# EAGLE schematic attiny85_transistor (EAGLE 9.3.1)
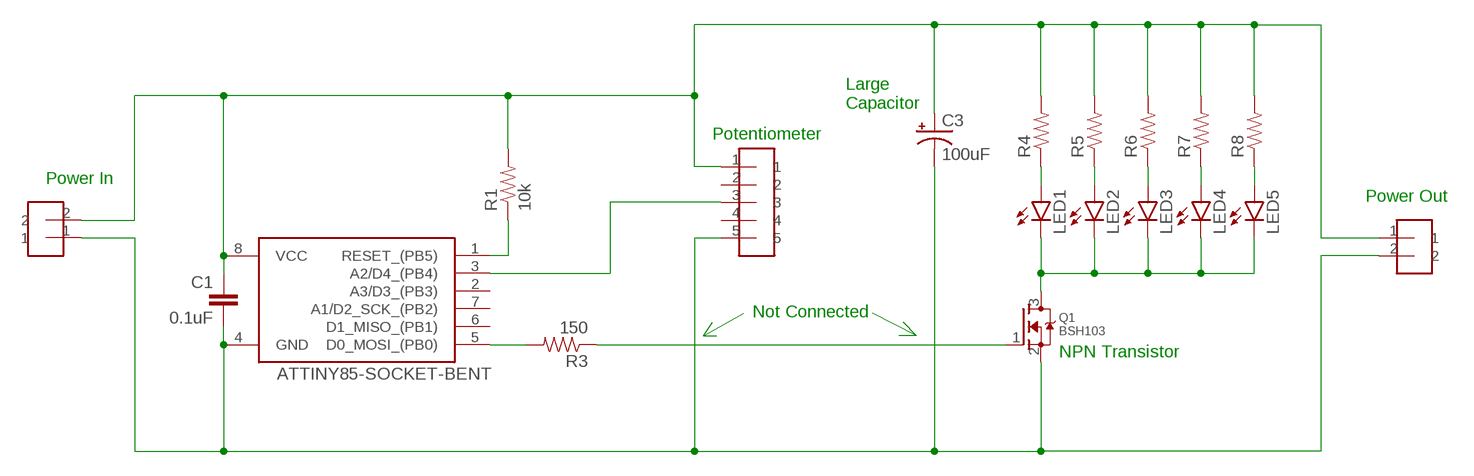
[diagram p0: schematic, sheet 1]

## Parts
C1  0.1uF  CAP-0805  [0805]
C3  100uF  CAP_POLD  [PANASONIC_D]
LED1  LED0603  [LED-0603]
LED2  LED0603  [LED-0603]
LED3  LED0603  [LED-0603]
LED4  LED0603  [LED-0603]
LED5  LED0603  [LED-0603]
POTENTIOMETER  HEADER-5  [HEADER-5]
Q1  BSH103  MOSFET-NREFLOW  [SOT23]
R1  10k  RESISTOR-0805  [0805]
R3  150  RESISTOR-0805  [0805]
R4  RESISTOR0603  [0603-RES]
R5  RESISTOR0603  [0603-RES]
R6  RESISTOR0603  [0603-RES]
R7  RESISTOR0603  [0603-RES]
R8  RESISTOR0603  [0603-RES]
U$1  ATTINY85-SOCKET-BENT  [SOCKET-8PIN-BENT]
U$2  HEADER-2  [HEADER-2]
U$3  HEADER-2  [HEADER-2]

## Nets
5V: C1.1 C3.+ POTENTIOMETER.1 R1.2 R4.2 R5.2 R6.2 R7.2 R8.2 U$1.8(VCC) U$2.2 U$3.1
GND: C1.2 C3.- POTENTIOMETER.5 Q1.2(S) U$1.4(GND) U$2.1 U$3.2
N$1: LED1.A R4.1
N$3: R3.2 U$1.5(D0_MOSI_(PB0))
N$4: LED1.C LED2.C LED3.C LED4.C LED5.C Q1.3(D)
N$5: Q1.1(G) R3.1
N$7: LED2.A R5.1
N$8: LED3.A R6.1
N$9: LED4.A R7.1
N$10: LED5.A R8.1
N$12: R1.1 U$1.1(RESET_(PB5))
SENSOR: POTENTIOMETER.3 U$1.3(A2/D4_(PB4))
Unconnected: POTENTIOMETER.2 POTENTIOMETER.4 U$1.2(A3/D3_(PB3)) U$1.6(D1_MISO_(PB1)) U$1.7(A1/D2_SCK_(PB2))

## Notes on the sheet
- Large
  Capacitor
- Potentiometer
- Power In
- Power Out
- Not Connected
- NPN Transistor

## Library data of the parts
C1 = homemade-hardware:CAP: Capacitor Standard 0603 ceramic capacitor, and 0.1" leaded capacitor.
C3 = homemade-hardware:CAP_POL: Capacitor Polarized These are standard SMD and PTH capacitors. Normally 10uF, 47uF, and 100uF in electrolytic and tantalum varieties. Always verify the external diameter of the through hole cap, it varies with capacity, voltage, and manufacturer. The EIA devices should be standard.
LED1-LED5 = homemade-hardware:LED: LEDs Standard schematic elements and footprints for 5mm, 3mm, 1206, and 0603 sized LEDs. 5mm - Spark Fun Electronics SKU : COM-00529 (and others)
POTENTIOMETER = homemade-hardware:HEADER-5
Q1 = adafruit:MOSFET-N: N-Channel Mosfet 2N7002E - 60V 260mA SOT23 [Digikey: 2N7002ET1GOSTR-ND] - REEL BSH103 - 30V 850mA SOT23 [Digikey: 568-5013-1-ND]
R1 R3-R8 = homemade-hardware:RESISTOR: Resistor Basic schematic elements and footprints for 0603, 1206, and PTH resistors.
U$1 = homemade-hardware:ATTINY85
U$2 U$3 = homemade-hardware:HEADER-2